# EasyEDA Pro project nikki_active_electrode_1.0.eprj

# Schematic BCI_ACTIVE_ELECTRODE
Board Name: CK-C3-Mini-085-4LY; Create Date: 2025-02-17; Page Name: Unity Gain OP-amp / Buffer / Voltage follower; Project Name: nikki_active_electrode_1.0; Schematic Name: BCI_ACTIVE_ELECTRODE; Update Date: 2025-10-02; Company: Designed by --nikki--; Page Size: A4; Version: V1.1
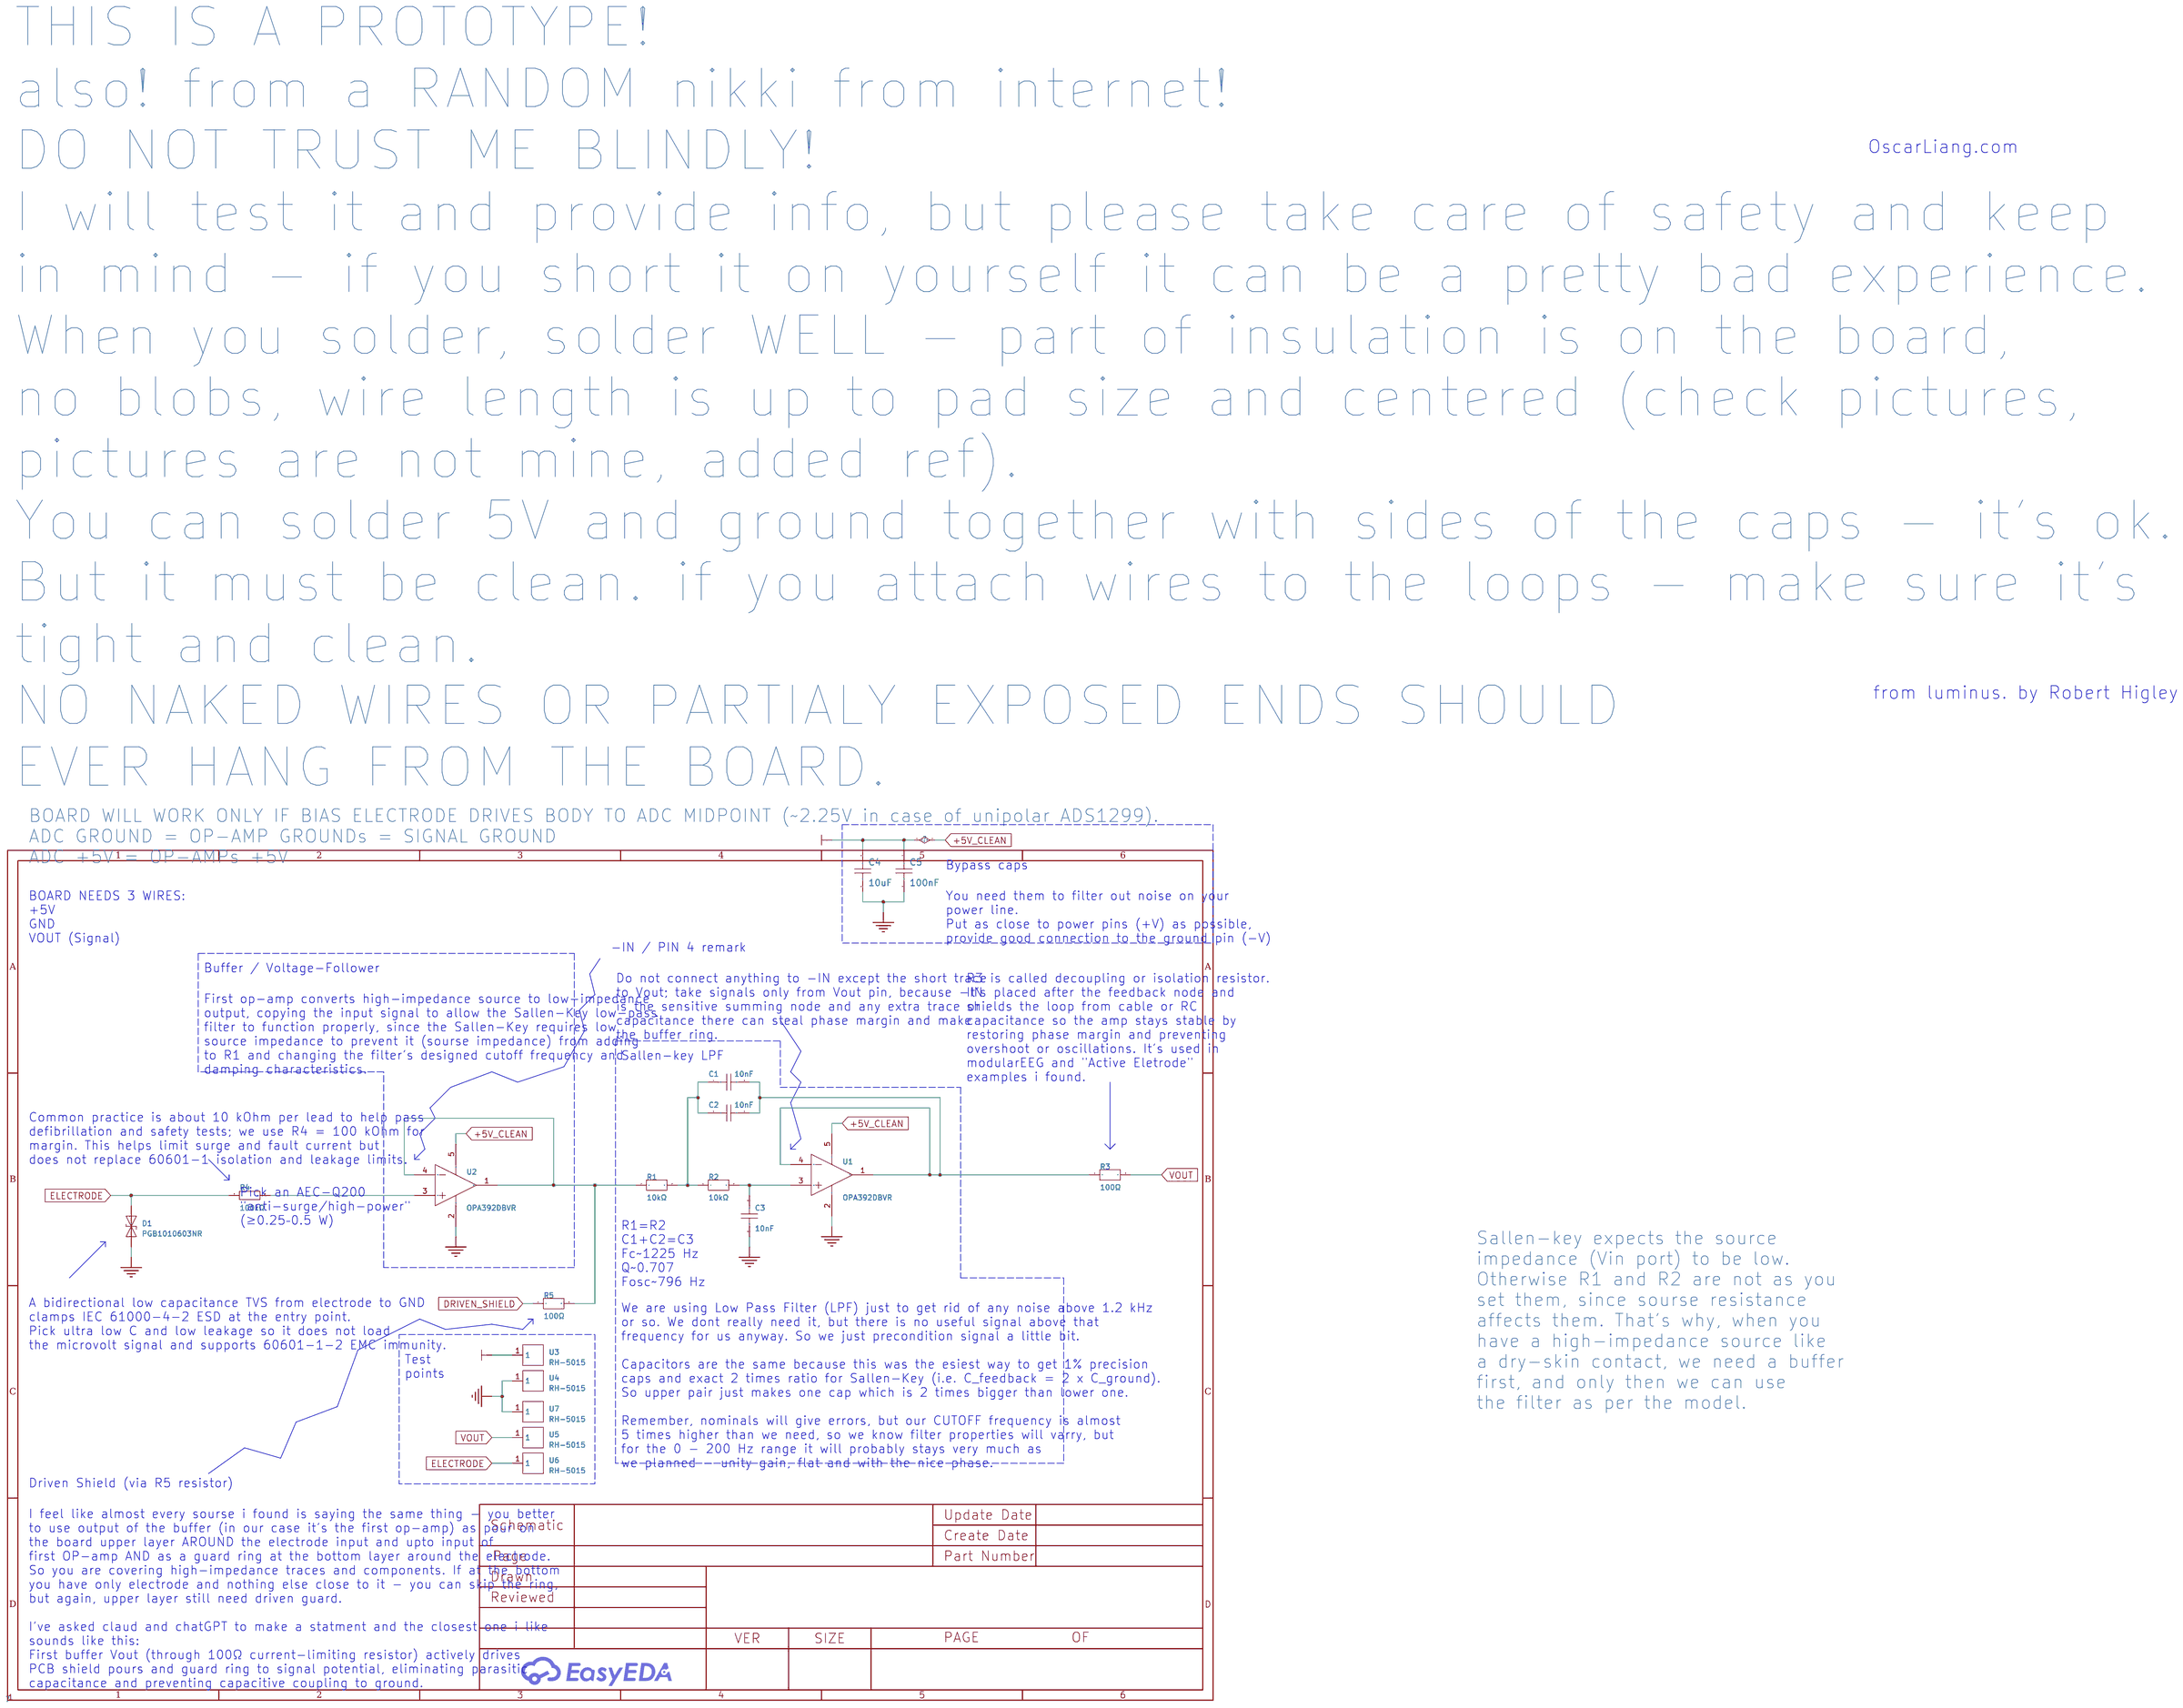
[diagram p0: schematic sheet]

## Parts
C1  10nF  [C0603]
C2  10nF  [C0603]
C3  10nF  [C0603]
C4  10uF  [C0603]
C5  100nF  [C0603]
D1  PGB1010603NR  [C0603]
R1  10kΩ  [C0603]
R2  10kΩ  [C0603]
R3  100Ω  [C0402 small]
R4  100kΩ  [R0805]
R5  100Ω  [C0402 small]
U1  OPA392DBVR  [SOT-23-5_L2.9-W1.6-P0.95-LS2.8-BL]
U2  OPA392DBVR  [SOT-23-5_L2.9-W1.6-P0.95-LS2.8-BL]
U3  RH-5015  [SMD_RH-5015]
U4  RH-5015  [SMD_RH-5015]
U5  RH-5015  [SMD_RH-5015]
U6  RH-5015  [SMD_RH-5015]
U7  RH-5015  [SMD_RH-5015]

## Library data of the parts
C1-C3 = GRM1885C1H103FA01D: Capacitance:10nF Tolerance:±1% Tolerance:±1% Voltage Rating:50V; LCSC Part Name: 10nF ±1% 50V; Supplier Part: C5299898; Manufacturer: muRata(村田); Supplier Footprint: 0603; JLCPCB Part Class: Extended Part; Datasheet: https://item.szlcsc.com/datasheet/GRM1885C1H103FA01D/6049911.html; Supplier: LCSC; Tolerance: ±1%; Voltage Rating: 50V
C4 = GRM188Z71A106MA73D: Capacitance: Tolerance:±20% Tolerance:±20% Voltage Rated: Temperature Coefficient:; LCSC Part Name: 10uF ±20% 10V; Supplier Part: C237435; Manufacturer: muRata(村田); Supplier Footprint: 0603; JLCPCB Part Class: Extended Part; Datasheet: https://atta.szlcsc.com/upload/public/pdf/source/20181211/C237435_300BF13F81FF0E5C4A93B9033DFC5A9C.pdf; Supplier: LCSC; Tolerance: ±20%
C5 = GRM188R71H104KA93D: Capacitance: Tolerance:±10% Tolerance:±10% Voltage Rated: Temperature Coefficient:; LCSC Part Name: 100nF ±10% 50V; Supplier Part: C77055; Manufacturer: muRata(村田); Supplier Footprint: 0603; JLCPCB Part Class: Extended Part; Datasheet: https://atta.szlcsc.com/upload/public/pdf/source/20200305/C490387_23319AE8C154DEB24C505E6C82A8106A.pdf; Supplier: LCSC; Tolerance: ±10%
D1 = PGB1010603NR: LCSC Part Name: 双向ESD; Supplier Part: C10677; Manufacturer: Littelfuse(美国力特); Supplier Footprint: 0603; JLCPCB Part Class: Extended Part; Datasheet: https://item.szlcsc.com/datasheet/PGB1010603NR/11221.html; Supplier: LCSC; Polarity: Bidirectional; Reverse Stand-Off Voltage (Vrwm): 24V; Clamping Voltage: 150V; Number of Channels: 1; Operating Temperature: -65℃~+125℃; level of protection: IEC 61000-4-2; Type: ESD; Junction Capacitance: 0.06pF
R1 R2 = RT0603BRD0710KL: Type:Thin Film Resistor Resistance:10kΩ Tolerance:±0.1% Tolerance:±0.1% Power(Watts):100mW Voltage-Supply(Max):75V Temperature Coefficient:±25ppm/℃ Temperature Coefficient:±25ppm/℃ Operating Temperature:-55℃~+155℃ Operating Temperature:-55℃~+155℃; LCSC Part Name: 薄膜电阻 10kΩ ±0.1% 100mW; Supplier Part: C95204; Manufacturer: YAGEO(国巨); Supplier Footprint: 0603; JLCPCB Part Class: Extended Part; Datasheet: https://atta.szlcsc.com/upload/public/pdf/source/20250609/0E6D5617EADA80FA3B707391883DF2D5.pdf; Supplier: LCSC; Type: Thin Film Resistor; Tolerance: ±0.1%; Power(Watts): 100mW; Voltage-Supply(Max): 75V; Temperature Coefficient: ±25ppm/℃; Operating Temperature: -55℃~+155℃
R3 R5 = RT0402BRD07100RL: LCSC Part Name: 薄膜电阻 100Ω ±0.1% 62.5mW; Supplier Part: C705627; Manufacturer: YAGEO(国巨); Supplier Footprint: 0402; JLCPCB Part Class: Extended Part; Datasheet: https://atta.szlcsc.com/upload/public/pdf/source/20250609/0E6D5617EADA80FA3B707391883DF2D5.pdf; Supplier: LCSC; Type: Thin Film Resistor; Tolerance: ±0.1%; Power(Watts): 62.5mW; Voltage-Supply(Max): 50V; Temperature Coefficient: ±25ppm/℃; Operating Temperature: -55℃~+155℃
R4 = 0805W8F1003T5E: Type:Thick Film Resistor Resistance:100kΩ Tolerance:±1% Tolerance:±1% Power(Watts):125mW Voltage-Supply(Max):150V Temperature Coefficient:±100ppm/℃ Temperature Coefficient:±100ppm/℃ Operating Temperature:-55℃~+155℃ Operating Temperature:-55℃~+155℃; LCSC Part Name: 100kΩ ±1% 125mW 厚膜电阻; Supplier Part: C149504; Manufacturer: UNI-ROYAL(厚声); Supplier Footprint: 0805; JLCPCB Part Class: Basic Part; Datasheet: https://item.szlcsc.com/datasheet/0805W8F1003T5E/160838.html; Supplier: LCSC; Type: Thick Film Resistor; Tolerance: ±1%; Power(Watts): 125mW; Voltage-Supply(Max): 150V; Temperature Coefficient: ±100ppm/℃; Operating Temperature: -55℃~+155℃
U1 U2 = OPA392DBVR: Supplier Part: C3647166; Manufacturer: TI(德州仪器); Supplier Footprint: SOT-23-5; JLCPCB Part Class: Extended Part; Datasheet: https://www.ti.com/cn/lit/gpn/opa392; Supplier: LCSC
U3-U7 = RH-5015: LCSC Part Name: PCB电路板测试点/测试针; Supplier Part: C5199798; Manufacturer: 荣和; JLCPCB Part Class: Extended Part; Datasheet: https://atta.szlcsc.com/upload/public/pdf/source/20231026/DF0E995FBD7BB891A195515CC364B170.pdf; Supplier: LCSC; Connector Type: Iron ring type (patch); Plastic Color: No plastic; Board Space (Diameter φ/ Length x Width): 2.67mmx1.02mm

## Nets
+5V: C4.1 C5.1 U1.5(V+) U2.5(V+) U3.1
GND: C3.1 C4.2 C5.2 D1.2 U1.2(V-) U2.2(V-) U4.1 U7.1
DRIVEN_SHIELD: R5.1
ELECTRODE: D1.1 R4.1 U6.1
VOUT: R3.2 U5.1
$1N414991: C1.1 C2.1 R1.2 R2.1
$1N414995: C3.2 R2.2 U1.3(IN +)
$1N416309: C1.2 C2.2 R3.1 U1.1(OUT) U1.4(IN -)
$1N417489: R4.2 U2.3(IN +)
$1N417512: R1.1 R5.2 U2.1(OUT) U2.4(IN -)

## Notes on the sheet
- THIS IS A PROTOTYPE!
  also! from a RANDOM nikki from internet!
  DO NOT TRUST ME BLINDLY!
  I will test it and provide info, but please take care of safety and keep
  in mind - if you short it on yourself it can be a pretty bad experience.
  When you solder, solder WELL - part of insulation is on the board,
  no blobs, wire length is up to pad size and centered (check pictures,
  pictures are not mine, added ref).
  You can solder 5V and ground together with sides of the caps - it's ok.
  But it must be clean. if you attach wires to the loops - make sure it's
  tight and clean.
  NO NAKED WIRES OR PARTIALY EXPOSED ENDS SHOULD
  EVER HANG FROM THE BOARD.
- OscarLiang.com
- from luminus. by Robert Higley
- BOARD WILL WORK ONLY IF BIAS ELECTRODE DRIVES BODY TO ADC MIDPOINT (~2.25V in case of unipolar ADS1299).
  ADC GROUND = OP-AMP GROUNDs = SIGNAL GROUND
  ADC +5V = OP-AMPs +5V
- Bypass caps
- BOARD NEEDS 3 WIRES:
  +5V
  GND
  VOUT (Signal)
- You need them to filter out noise on your
  power line.
  Put as close to power pins (+V) as possible,
  provide good connection to the ground pin (-V)
- -IN / PIN 4 remark
- Buffer / Voltage-Follower
- Do not connect anything to -IN except the short trace
  to Vout; take signals only from Vout pin, because -IN
  is the sensitive summing node and any extra trace or
  capacitance there can steal phase margin and make
  the buffer ring.
- R3 is called decoupling or isolation resistor.
  It's placed after the feedback node and
  shields the loop from cable or RC
  capacitance so the amp stays stable by
  restoring phase margin and preventing
  overshoot or oscillations. It's used in
  modularEEG and "Active Eletrode"
  examples i found.
- First op-amp converts high-impedance source to low-impedance
  output, copying the input signal to allow the Sallen-Key low-pass
  filter to function properly, since the Sallen-Key requires low
  source impedance to prevent it (sourse impedance) from adding
  to R1 and changing the filter's designed cutoff frequency and
  damping characteristics.
- Sallen-key LPF
- Common practice is about 10 kOhm per lead to help pass
  defibrillation and safety tests; we use R4 = 100 kOhm for
  margin. This helps limit surge and fault current but
  does not replace 60601-1 isolation and leakage limits.
- Pick an AEC-Q200
  "anti-surge/high-power"
  (≥0.25–0.5 W)
- R1=R2
  C1+C2=C3
  Fc~1225 Hz
  Q~0.707
  Fosc~796 Hz
- Sallen-key expects the source
  impedance (Vin port) to be low.
  Otherwise R1 and R2 are not as you
  set them, since sourse resistance
  affects them. That's why, when you
  have a high-impedance source like
  a dry-skin contact, we need a buffer
  first, and only then we can use
  the filter as per the model.
- A bidirectional low capacitance TVS from electrode to GND
  clamps IEC 61000-4-2 ESD at the entry point.
  Pick ultra low C and low leakage so it does not load
  the microvolt signal and supports 60601-1-2 EMC immunity.
- We are using Low Pass Filter (LPF) just to get rid of any noise above 1.2 kHz
  or so. We dont really need it, but there is no useful signal above that
  frequency for us anyway. So we just precondition signal a little bit.
  Capacitors are the same because this was the esiest way to get 1% precision
  caps and exact 2 times ratio for Sallen-Key (i.e. C_feedback = 2 x C_ground).
  So upper pair just makes one cap which is 2 times bigger than lower one.
  Remember, nominals will give errors, but our CUTOFF frequency is almost
  5 times higher than we need, so we know filter properties will varry, but
  for the 0 - 200 Hz range it will probably stays very much as
  we planned - unity gain, flat and with the nice phase.
- Test
  points
- Driven Shield (via R5 resistor)
- I feel like almost every sourse i found is saying the same thing - you better
  to use output of the buffer (in our case it's the first op-amp) as pour on
  the board upper layer AROUND the electrode input and upto input of
  first OP-amp AND as a guard ring at the bottom layer around the electrode.
  So you are covering high-impedance traces and components. If at the bottom
  you have only electrode and nothing else close to it - you can skip the ring,
  but again, upper layer still need driven guard.
  I've asked claud and chatGPT to make a statment and the closest one i like
  sounds like this:
  First buffer Vout (through 100Ω current-limiting resistor) actively drives
  PCB shield pours and guard ring to signal potential, eliminating parasitic
  capacitance and preventing capacitive coupling to ground.

# Board BCI_Board
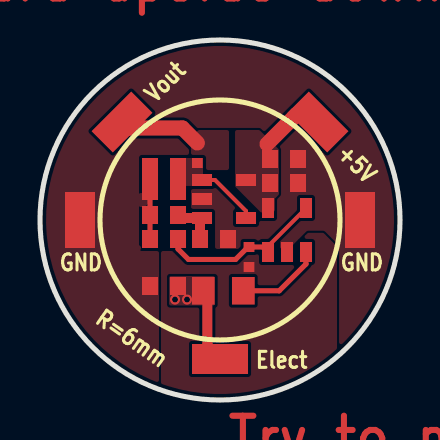
[diagram p1: board, top side]
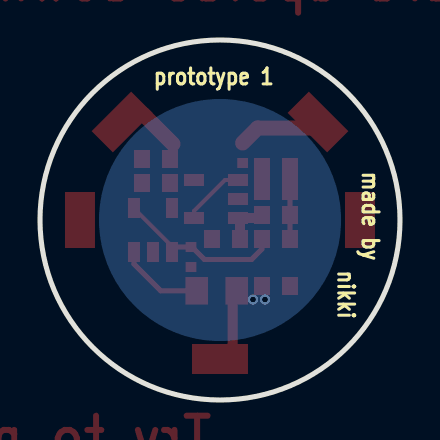
[diagram p2: board, bottom side, seen from below]

Outline 18 x 18 mm; copper layers: Top Layer, Bottom Layer. Coordinates in mm from the lower left corner of the outline.
Outline path: circle c9,9 r9
Stack: Top Layer 0.035mm / Dielectric1 0.71mm FR4 er 4.5 / Bottom Layer 0.035mm

## Design rules (mm)
template: 用户自定义配置
spacing Default (default): track to track 0.127, other pairs 0 to 0.127
track width Default (default): min 0.127, default 0.127, max 25.4
differential pair differentialPair (default): width min 0.127, default 0.254, max 2.54; gap min 0.152, default 0.152
via Default (default): diameter min 0.5, default 0.61, max 100.025; hole min 0.3, default 0.305, max 59.995
net DRIVEN_SHIELD uses copperRegion1
pour e1326 uses copperRegion1
pour e3427 uses copperRegion1
pour e2249 uses copperRegion1
pour e4546 uses copperRegion1
pour e4934 uses gge20879(1)
pour e5639 uses copperRegion1
pour e617 uses copperRegion1

## Placement (name value [footprint] x y rotation side)
C1  10nF  [C0603]  6.2 11.65 0 top
C2  10nF  [C0603]  6.2 10.45 0 top
C3  10nF  [C0603]  8.7 8.05 180 top
C4  10uF  [C0603]  12.2 12.05 0 top
C5  100nF  [C0603]  12.2 10.85 0 top
D1  PGB1010603NR  [C0603]  6.2 5.7 180 top
R1  10kΩ  [C0603]  6.2 8.05 180 top
R2  10kΩ  [C0603]  6.2 9.25 0 top
R3  100Ω  [C0402 small]  7.87 12.35 90 top
R4  100kΩ  [R0805]  9.17 5.46 0 top
R5  100Ω  [C0402 small]  10.45 7.15 90 top
U1  OPA392DBVR  [SOT-23-5_L2.9-W1.6-P0.95-LS2.8-BL]  9.2 10.05 270 top
U2  OPA392DBVR  [SOT-23-5_L2.9-W1.6-P0.95-LS2.8-BL]  12.35 8.5 0 top
U3  RH-5015  [SMD_RH-5015]  13.9 13.9 315 top
U4  RH-5015  [SMD_RH-5015]  2 9 90 top
U5  RH-5015  [SMD_RH-5015]  4.1 13.9 45 top
U6  RH-5015  [SMD_RH-5015]  9 2.05 0 top
U7  RH-5015  [SMD_RH-5015]  16 9 90 top

## Footprints (pads in the part's own frame, mm; a bottom-side part is the same pattern mirrored in y, then rotated)
C0402 small
  rect 0.5x0.54 smd: 1(-0.5,0) 2(0.5,0)
C0603
  rect 0.8x0.9 smd: 1(-0.7,0) 2(0.7,0)
R0805
  rect 1.133x1.377 smd: 1(-1,0) 2(1,0)
SMD_RH-5015
  rect 2.8x1.5 smd: 1(0,0)
SOT-23-5_L2.9-W1.6-P0.95-LS2.8-BL
  rect 0.6x1 smd: 1(-0.95,-1.1) 2(0,-1.1) 3(0.95,-1.1) 4(0.95,1.1) 5(-0.95,1.1)

## Nets
As in the schematic.

## Via types
v1: diameter 0.5, hole 0.3, Top Layer to Bottom Layer, 2 vias

## Routing (per net, layer and track width the routed paths; a pad name or vN(x,y) marks a point on that pad's centre or on a via; arc(x,y) is an arc through that point)
+5V: length 3.3
  Top Layer w0.75: 11.35,12.8 12.83,14.28 13.47,14.28 13.85,13.9
ELECTRODE: length 3.2
  Top Layer w0.5: 8.37,4.95 8.37,2.73 9.03,2.06
  vias: v1(6.75,5.02) v1(7.35,5.02)
VOUT: length 4.2
  Top Layer w0.75: U5.1 4.4,13.6 7.12,13.6 R3.2
$1N414991: length 3.5
  Top Layer w0.254: 5.5,8.1 R2.1 5.5,10.4
  Top Layer w0.8: 5.5,11.55 5.5,10.4
$1N414995: length 2.3
  Top Layer w0.5: 6.95,9.25 7.1,9.1 8.1,9.1 8,9 8,8.05
$1N416309: length 4.3
  Top Layer w0.2: 10.3,9.1 10.3,9.45 8.75,11 8.1,11
  Top Layer w0.8: 6.9,11.55 6.9,10.4
$1N417489: length 4.3
  Top Layer w0.254: R4.2 11.96,5.46 13.3,6.8 13.3,7.4
$1N417512: length 8.7
  Top Layer w0.2: 13.25,9.28 13.25,9.3 ; 11.4,7.68 13.3,9.58
  Top Layer w0.254: 11.23,7.03 11.4,7.2 11.4,7.4 ; 11.4,7.4 11.15,7.65 10.4,7.65 9.78,7.03 7.42,7.03 6.9,7.55 6.9,8.05 R1.1

## Copper pours and planes (outline as drawn; the poured copper is in the pictures)
+5V on Top Layer: 9.8,13.45 9.8,10.7 11.08,9.42 11.62,9.42 11.7,9.5 11.7,10.1 11.9,10.3 11.9,12.5 10.95,13.45
GND on Top Layer: -1.05,18 18.6,18 18.6,0.05 -1.05,0.05
DRIVEN_SHIELD on Top Layer: 6.1,7.4 12.5,7.4 13.42,8.31 14.15,8.31 14.8,7.66 14.8,1.95 12.95,0.1 6.1,0.1
ELECTRODE on Top Layer: 6.5,6.15 8.7,6.15 8.7,4.77 6.5,4.77
ELECTRODE on Bottom Layer: 15,9.24 14.96,9.71 14.88,10.17 14.77,10.63 14.63,11.08 14.45,11.51 14.23,11.93 13.99,12.33 13.71,12.71 13.41,13.07 13.07,13.41 12.71,13.71 12.33,13.99 11.93,14.23 11.51,14.45 11.08,14.63 10.63,14.77 10.17,14.88 9.71,14.96 9.24,15 8.76,15 8.29,14.96 7.83,14.88 7.37,14.77 6.92,14.63 6.49,14.45 6.07,14.23 5.67,13.99 5.29,13.71 4.93,13.41 4.59,13.07 4.29,12.71 4.01,12.33 3.77,11.93 3.55,11.51 3.37,11.08 3.23,10.63 3.12,10.17 3.04,9.71 3,9.24 3,8.76 3.04,8.29 3.12,7.83 3.23,7.37 3.37,6.92 3.55,6.49 3.77,6.07 4.01,5.67 4.29,5.29 4.59,4.93 4.93,4.59 5.29,4.29 5.67,4.01 6.07,3.77 6.49,3.55 6.92,3.37 7.37,3.23 7.83,3.12 8.29,3.04 8.76,3 9.24,3 9.71,3.04 10.17,3.12 10.63,3.23 11.08,3.37 11.51,3.55 11.93,3.77 12.33,4.01 12.71,4.29 13.07,4.59 13.41,4.93 13.71,5.29 13.99,5.67 14.23,6.07 14.45,6.49 14.63,6.92 14.77,7.37 14.88,7.83 14.96,8.29 15,8.76
VOUT on Top Layer: 9.4,13.45 7.95,13.45 7.6,13.1 7.6,11.55 9.4,11.55
$1N416309 on Top Layer: 6.5,12.1 8.15,12.1 8.15,10.7 6.5,10.7

## Text on the board
Bottom Silkscreen Layer: prototype 1 | made by | nikki
Top Layer: Separate GND, signal and +V at the soldering points genrerously. / You could make everything supa small, but whats / the point if it also should be safe. So make bigger / gaps, make a tail on the coin if it's needed. / And for the testig setup you dont even need vias, you could just flip / the board upside down  and you will get everything to test :3 | Try to make sure input from electrode as far from / all the other components to provide the best isolation. / I mean, that is silly comment, but inside the opamps / they can be tight, but move input traces and components far away.
Top Silkscreen Layer: GND | Elect | Vout | +5V | R=6mm
